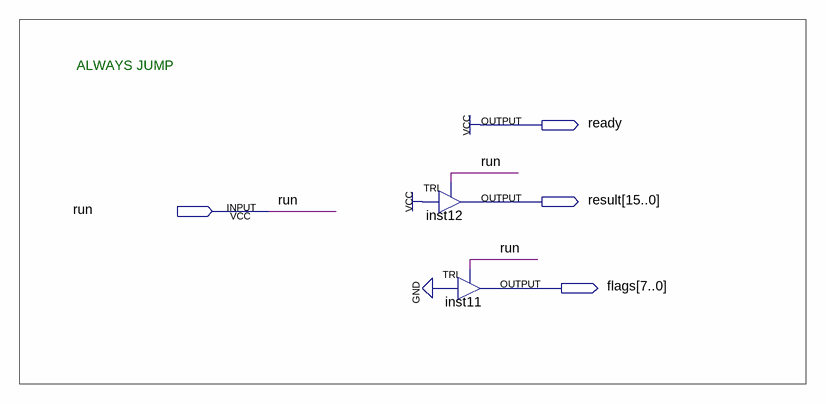
[diagram p0: schematic sheet]
// Quartus schematic EX_JMP.bdf as structural Verilog: 2 symbols, 4 pins
module EX_JMP (
  input  run,
  output ready,
  output [15:0] result,
  output [7:0] flags
);

  TRI inst12[15:0] (.IN(1'b1), .OE(run), .OUT(result));
  TRI inst11[7:0] (.IN(1'b0), .OE(run), .OUT(flags));

  assign ready = 1'b1;

  // Notes on the sheet:
  //   ALWAYS JUMP
endmodule
